# Altium schematic sheet pca63519 - Keyboard.SchDoc: PCA63519 - Smart Remote 3 DK shield - Keyboard
size A4; DocumentNumber: 4; Revision: 1.2.1; SheetNumber: 4; SheetTotal: 6; DrawnBy: GETR; ProjectNumber: 4414; DocumentSize: A4; PCBRevision: 0049GETR; PCAName: PCA63519; PCBNumber: 400129
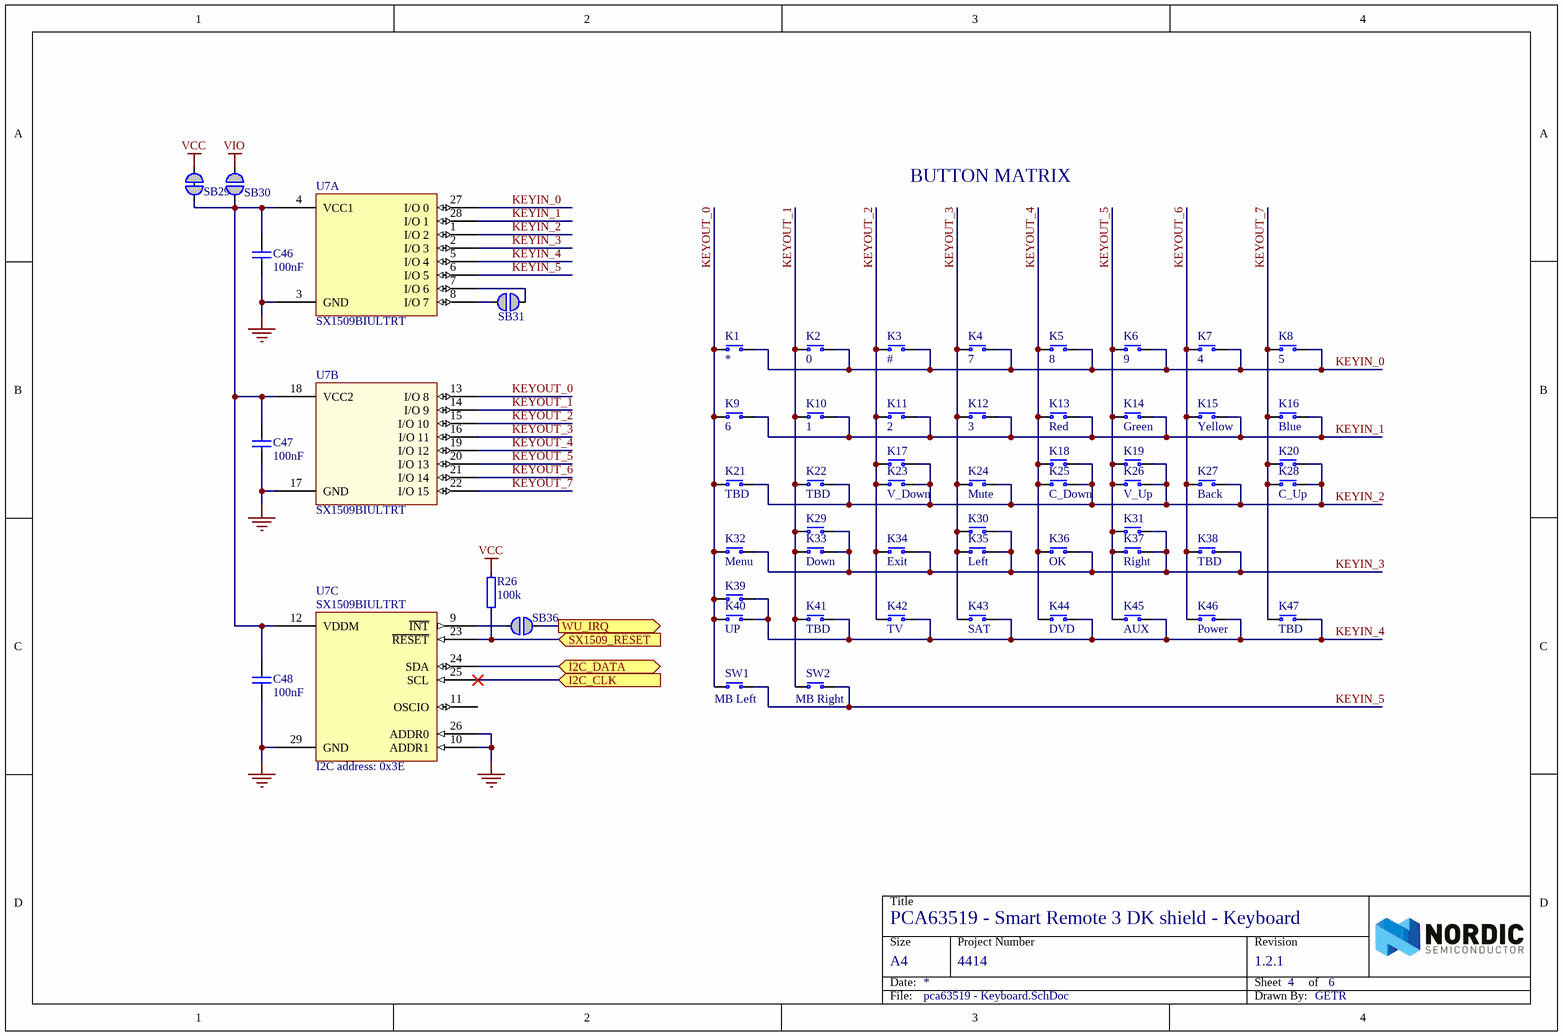
[diagram p0: pca63519 - Keyboard.SchDoc]

## Parts
C46  100nF  [CAPC1005X04L]
C47  100nF  [CAPC1005X04L]
C48  100nF  [CAPC1005X04L]
K1  *  [PCB Switch]  (no BOM)
K2  0  [PCB Switch]  (no BOM)
K3  #  [PCB Switch]  (no BOM)
K4  7  [PCB Switch]  (no BOM)
K5  8  [PCB Switch]  (no BOM)
K6  9  [PCB Switch]  (no BOM)
K7  4  [PCB Switch]  (no BOM)
K8  5  [PCB Switch]  (no BOM)
K9  6  [PCB Switch]  (no BOM)
K10  1  [PCB Switch]  (no BOM)
K11  2  [PCB Switch]  (no BOM)
K12  3  [PCB Switch]  (no BOM)
K13  Red  [PCB Switch]  (no BOM)
K14  Green  [PCB Switch]  (no BOM)
K15  Yellow  [PCB Switch]  (no BOM)
K16  Blue  [PCB Switch]  (no BOM)
K17  PCB SW  [PCB Switch]  (value not drawn)  (no BOM)
K18  PCB SW  [PCB Switch]  (value not drawn)  (no BOM)
K19  PCB SW  [PCB Switch]  (value not drawn)  (no BOM)
K20  PCB SW  [PCB Switch]  (value not drawn)  (no BOM)
K21  TBD  [PCB Switch]  (no BOM)
K22  TBD  [PCB Switch]  (no BOM)
K23  V_Down  [PCB Switch]  (no BOM)
K24  Mute  [PCB Switch]  (no BOM)
K25  C_Down  [PCB Switch]  (no BOM)
K26  V_Up  [PCB Switch]  (no BOM)
K27  Back  [PCB Switch]  (no BOM)
K28  C_Up  [PCB Switch]  (no BOM)
K29  PCB SW  [PCB Switch]  (value not drawn)  (no BOM)
K30  PCB SW  [PCB Switch]  (value not drawn)  (no BOM)
K31  PCB SW  [PCB Switch]  (value not drawn)  (no BOM)
K32  Menu  [PCB Switch]  (no BOM)
K33  Down  [PCB Switch]  (no BOM)
K34  Exit  [PCB Switch]  (no BOM)
K35  Left  [PCB Switch]  (no BOM)
K36  OK  [PCB Switch]  (no BOM)
K37  Right  [PCB Switch]  (no BOM)
K38  TBD  [PCB Switch]  (no BOM)
K39  PCB SW  [PCB Switch]  (value not drawn)  (no BOM)
K40  UP  [PCB Switch]  (no BOM)
K41  TBD  [PCB Switch]  (no BOM)
K42  TV  [PCB Switch]  (no BOM)
K43  SAT  [PCB Switch]  (no BOM)
K44  DVD  [PCB Switch]  (no BOM)
K45  AUX  [PCB Switch]  (no BOM)
K46  Power  [PCB Switch]  (no BOM)
K47  TBD  [PCB Switch]  (no BOM)
R26  100k  [RESC1005X04L]
SB29  Solderbridge  [Solderbridge_SHORTED_0.4]  (value not drawn)  (net tie, no BOM)
SB30  Solderbridge  [Solderbridge_0.4]  (value not drawn)  (no BOM)
SB31  Solderbridge  [Solderbridge_0.4]  (value not drawn)  (no BOM)
SB36  Solderbridge  [Solderbridge_0.4]  (value not drawn)  (no BOM)
SW1  MB Left  [ALPS_SKHUxxx010_WO_GND]
SW2  MB Right  [ALPS_SKHUxxx010_WO_GND]
U7  SX1509BIULTRT  [QFN40P400X400X60_HS-29N]  (parts A,B,C of 3)

## Ports
I2C_CLK (in), I2C_DATA (bidir), SX1509_RESET (in), WU_IRQ (out)

## Nets
GND: C46.1 C47.1 C48.1 U7.3(GND) U7.10(ADDR1) U7.17(GND) U7.26(ADDR0) U7.29(GND)
VCC: R26.2 SB29.1
VIO: SB30.1
I2C_CLK: U7.25(SCL) ; port I2C_CLK
I2C_DATA: U7.24(SDA) ; port I2C_DATA
KEYIN_0: K1.1(N.O) K2.1(N.O) K3.1(N.O) K4.1(N.O) K5.1(N.O) K6.1(N.O) K7.1(N.O) K8.1(N.O) U7.27(I/O_0)
KEYIN_1: K9.1(N.O) K10.1(N.O) K11.1(N.O) K12.1(N.O) K13.1(N.O) K14.1(N.O) K15.1(N.O) K16.1(N.O) U7.28(I/O_1)
KEYIN_2: K17.1(N.O) K18.1(N.O) K19.1(N.O) K20.1(N.O) K21.1(N.O) K22.1(N.O) K23.1(N.O) K24.1(N.O) K25.1(N.O) K26.1(N.O) K27.1(N.O) K28.1(N.O) U7.1(I/O_2)
KEYIN_3: K29.1(N.O) K30.1(N.O) K31.1(N.O) K32.1(N.O) K33.1(N.O) K34.1(N.O) K35.1(N.O) K36.1(N.O) K37.1(N.O) K38.1(N.O) U7.2(I/O_3)
KEYIN_4: K39.1(N.O) K40.1(N.O) K41.1(N.O) K42.1(N.O) K43.1(N.O) K44.1(N.O) K45.1(N.O) K46.1(N.O) K47.1(N.O) U7.5(I/O_4)
KEYIN_5: SW1.1(N.O) SW2.1(N.O) U7.6(I/O_5)
KEYOUT_0: K1.2(COM) K9.2(COM) K21.2(COM) K32.2(COM) K39.2(COM) K40.2(COM) SW1.2(COM) U7.13(I/O_8)
KEYOUT_1: K2.2(COM) K10.2(COM) K22.2(COM) K29.2(COM) K33.2(COM) K41.2(COM) SW2.2(COM) U7.14(I/O_9)
KEYOUT_2: K3.2(COM) K11.2(COM) K17.2(COM) K23.2(COM) K34.2(COM) K42.2(COM) U7.15(I/O_10)
KEYOUT_3: K4.2(COM) K12.2(COM) K24.2(COM) K30.2(COM) K35.2(COM) K43.2(COM) U7.16(I/O_11)
KEYOUT_4: K5.2(COM) K13.2(COM) K18.2(COM) K25.2(COM) K36.2(COM) K44.2(COM) U7.19(I/O_12)
KEYOUT_5: K6.2(COM) K14.2(COM) K19.2(COM) K26.2(COM) K31.2(COM) K37.2(COM) K45.2(COM) U7.20(I/O_13)
KEYOUT_6: K7.2(COM) K15.2(COM) K27.2(COM) K38.2(COM) K46.2(COM) U7.21(I/O_14)
KEYOUT_7: K8.2(COM) K16.2(COM) K20.2(COM) K28.2(COM) K47.2(COM) U7.22(I/O_15)
SX1509_RESET: R26.1 U7.23(~{RESET}) ; port SX1509_RESET
WU_IRQ: SB36.1 ; port WU_IRQ
NetC46_2: C46.2 C47.2 C48.2 SB29.2 SB30.2 U7.4(VCC1) U7.12(VDDM) U7.18(VCC2)
NetSB31_1: SB31.1 U7.8(I/O_7)
NetSB31_2: SB31.2 U7.7(I/O_6)
NetSB36_2: SB36.2 U7.9(~{INT})

Not connected (* = marked no-connect by the designer): U7 11(OSCIO)

## Notes on the sheet
- BUTTON MATRIX
- (near U7) I2C address: 0x3E
- Title
- Size
- Date:
- Project Number
- Sheet         of
- Revision
- File:
- Drawn By:

## Library data of the parts
C46-C48 = C0402-100n: Capacitor, X7R, ±10%; Note: 16V; Artikkelnr Noca: 20039200; Artikkelnr Simpro: N.A.; Part Number: C0402-100n; Manufacturer: *; Manufacturer Part Number: *; Datasheet: *; LatestRevisionDate: 2009-11-23; Pin Count: 2; Publisher: Nordic Semiconductor; Published: 2009-05-08; Value: 100nF; Supplier: *; Supplier part number: *; 2nd source Supplier: *; 2nd source part number: *; Footprint Doc: 0402
K1-K16 K21-K28 K32-K38 K40-K47 = KEY_SWITCH_SR3: Keyboard matrix switch; Value: PCB SW; Artikkelnr Noca: N.A.; Part Number: KEY_SWITCH_SR3; Manufacturer: *; Manufacturer Part Number: *; Datasheet: *; LatestRevisionDate: 2015-05-05; Pin Count: 2; Publisher: Nordic Semiconductor; Published: 2015-05-05; Note: *; Supplier: *; Supplier part number: *; 2nd source Supplier: *; 2nd source part number: *; Footprint Doc: *; Artikkelnr Simpro: N.A.
K17-K20 K29-K31 K39 = KEY_SWITCH_SR3: Keyboard matrix switch; Artikkelnr Noca: N.A.; Part Number: KEY_SWITCH_SR3; Manufacturer: *; Manufacturer Part Number: *; Datasheet: *; LatestRevisionDate: 2015-05-05; Pin Count: 2; Publisher: Nordic Semiconductor; Published: 2015-05-05; Value: PCB SW; Note: *; Supplier: *; Supplier part number: *; 2nd source Supplier: *; 2nd source part number: *; Footprint Doc: *; Artikkelnr Simpro: N.A.
R26 = R0402-100k: Resistor, ±1%, 0.063W; Note: Chip Res 1%; Artikkelnr Noca: 27049121; Artikkelnr Simpro: N.A.; Value Ohm: 100000; Part Number: R0402-100k; Manufacturer: *; Manufacturer Part Number: *; Datasheet: *; Footprint Doc: 0402; LatestRevisionDate: 2009-11-23; Pin Count: 2; Publisher: Nordic Semiconductor; Published: 2009-05-08; Value: 100k; Supplier: Farnell; Supplier part number: 173-8877; 2nd source Supplier: *; 2nd source part number: *
SB29 = Solderbridge Shorted 0.4mm: Shorted Solderbridge; Artikkelnr Noca: N.A.; Part Number: Solderbridge Shorted 0.4mm; Manufacturer: *; Manufacturer Part Number: *; Datasheet: *; Footprint Doc: Solderbridge_Shorted; LatestRevisionDate: 2012-08-07; Pin Count: 2; Publisher: Nordic Semiconductor; Published: 2012-08-07; Value: Solderbridge; Note: *; Supplier: *; Supplier part number: *; 2nd source Supplier: *; 2nd source part number: *; Artikkelnr Simpro: N.A.
SB30 SB31 SB36 = Solderbridge 0.4mm: Artikkelnr Noca: N.A.; Part Number: Solderbridge 0.4mm; Manufacturer: *; Manufacturer Part Number: *; Datasheet: *; Footprint Doc: Solderbridge; LatestRevisionDate: 2009-12-14; Pin Count: 2; Publisher: Nordic Semiconductor; Published: 2009-12-14; Value: Solderbridge; Note: *; Supplier: *; Supplier part number: *; 2nd source Supplier: *; 2nd source part number: *; Artikkelnr Simpro: N.A.
SW1 SW2 = ALPS_SKHUALE010: ALPS - SKHUALE010 - Tactile Switch, SPNO, SMD, 6.5x6.2x2.5mm; 2nd source part number: 688-SKHUALE010; Value: PB SW; Artikkelnr Noca: 50019001; Artikkelnr Simpro: N.A.; Part Number: ALPS_SKHUALE010; Manufacturer: Alps; Manufacturer Part Number: SKHUALE010; Datasheet: https://www1.elfa.se/data1/wwwroot/webroot/Z_DATA/03579000.pdf; LatestRevisionDate: 2010-02-01; Pin Count: 4; Publisher: Nordic Semiconductor; Published: 2010-02-01; Note: *; Supplier: Elfa; Supplier part number: 35-790-00; 2nd source Supplier: Mouser; Footprint Doc: ALPS_SKHUxxx010_WO_GND
U7 = SX1509BIULTRT: IC GPIO EXPANDER I2C 16CH 28QFN; Manufacturer: Semtech Corporation; Artikkelnr Noca: N.A.; Part Number: SX1509BIULTRT; Manufacturer Part Number: SX1509BIULTRT; Datasheet: http://www.semtech.com/apps/product.php?pn=sx1509&x=0&y=0; Footprint Doc: QFN-28; LatestRevisionDate: 2015-03-10; Pin Count: 29; Publisher: Nordic Semiconductor; Published: 2015-03-10; Value: SX1509BIULTRT; Note: *; Supplier: Digi-Key; Supplier part number: SX1509BIULCT-ND; 2nd source Supplier: *; 2nd source part number: *; Artikkelnr Simpro: N.A.